# Altium schematic sheet OPA847_LNA.SchDoc
size A4; SheetNumber: 3; SheetTotal: 9
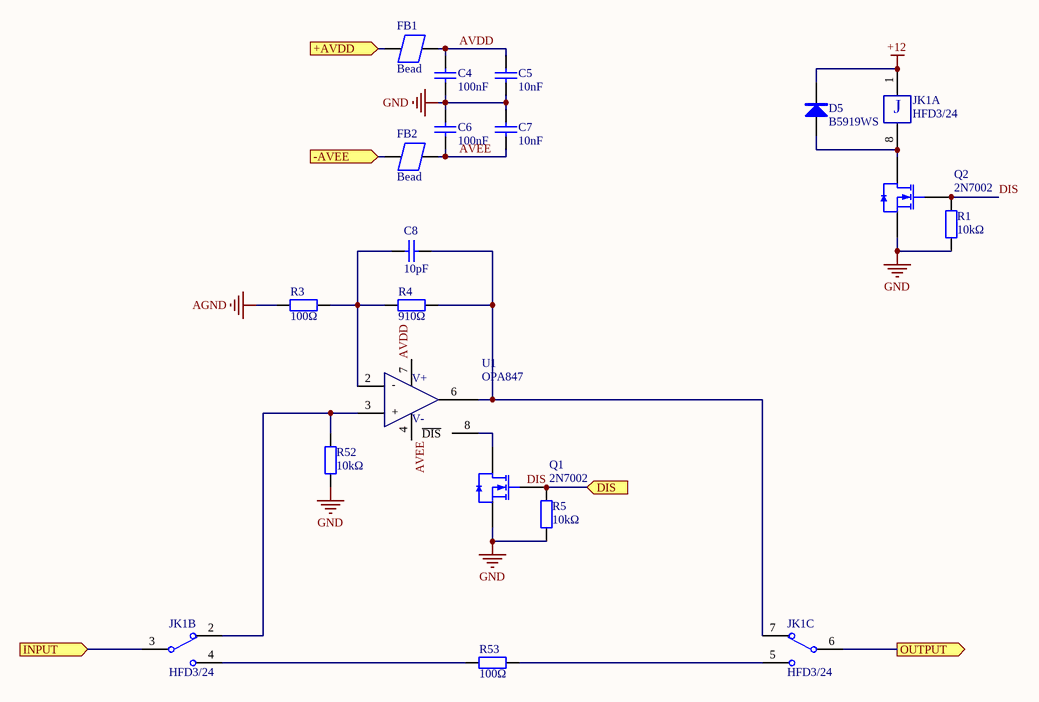
[diagram p0: OPA847_LNA.SchDoc]

## Parts
C4  100nF  [0603_C]
C5  10nF  [0603_C]
C6  100nF  [0603_C]
C7  10nF  [0603_C]
C8  10pF  [0603_C]
D5  B5919WS  [SOD-323]
FB1  Bead  [0805_L]
FB2  Bead  [0805_L]
JK1  HFD3/24  [HFD3-DIP]  (parts A,B,C of 3)
Q1  2N7002  [SOT-23(SOT-23-3)]
Q2  2N7002  [SOT-23(SOT-23-3)]
R1  10kΩ  [0603_R]
R3  100Ω  [0603_R]
R4  910Ω  [0603_R]
R5  10kΩ  [0603_R]
R52  10kΩ  [0603_R]
R53  100Ω  [0603_R]
U1  OPA847  [SOIC127P600X175-8M]

## Ports
+AVDD (in), -AVEE (in), DIS (in), INPUT (in), OUTPUT (out)

## Nets
+12: D5.2(K) JK1.1
AGND: R3.1
GND: C4.1 C5.1 C6.1 C7.1 Q1.2(S) Q2.2(S) R1.1 R5.1 R52.1
+AVDD: FB1.1 ; port +AVDD
-AVEE: FB2.1 ; port -AVEE
AVDD: C4.2 C5.2 FB1.2 U1.7(VCC+)
AVEE: C6.2 C7.2 FB2.2 U1.4(VCC-)
DIS: Q1.1(G) R5.2 ; port DIS
DIS: Q2.1(G) R1.2  [a separate net that carries the same name]
INPUT: JK1.3 ; port INPUT
OUTPUT: JK1.6 ; port OUTPUT
NetC8_1: C8.1 R3.2 R4.1 U1.2
NetC8_2: C8.2 JK1.7 R4.2 U1.6
NetD5_1: D5.1(A) JK1.8 Q2.3(D)
NetJK1_2: JK1.2 R52.2 U1.3
NetJK1_4: JK1.4 R53.2
NetJK1_5: JK1.5 R53.1
NetQ1_3: Q1.3(D) U1.8(~{DIS})

## Notes on the sheet
- Labels drawn without touching a wire or pin: DIS
- (in symbol HFD3, part A) J
- (in symbol OPA847) V+; -; +; V-

## Library data of the parts
C4 C6 = 0603 100nF (104) 10% 50V: 贴片电容; ComponentLink1Description: 供应商链接; ComponentLink1URL: http://www.szlcsc.com/product/details_15331.html; Package: 0603; Supplier: LC; SuppliersPartNumber: C14663
C5 C7 = 0603 10nF (103) 10% 50V: 贴片电容; ComponentLink1Description: 供应商链接; ComponentLink1URL: http://www.szlcsc.com/product/details_58143.html; Package: 0603; Supplier: LC; SuppliersPartNumber: C57112
C8 = 0603 10pF (100) 5% 50V: 贴片电容; ComponentLink1Description: 供应商链接; ComponentLink1URL: http://www.szlcsc.com/product/details_1986.html; Package: 0603; Supplier: LC; SuppliersPartNumber: C1634
D5 = 1N5819: 肖特基二极管; 版权归属: 源创客; 属性: 40V/2A; BOM名称: 肖特基二极管; 学习资源: www.ooocke.com
JK1 = HFD3: 超小型两组转换; BOM名称: 两组转换继电器; 版权归属: 源创客; 学习资源: www.ooocke.com
Q1 Q2 = 2N7002 7002: MOS(场效应管); ComponentLink1Description: 供应商链接; ComponentLink1URL: http://www.szlcsc.com/product/details_9040.html; Package: SOT-23(SOT-23-3); Supplier: LC; SuppliersPartNumber: C8545
R1 R5 = 0603 10KΩ (1002) 1%: 贴片电阻; ComponentLink1Description: 供应商链接; ComponentLink1URL: http://www.szlcsc.com/product/details_26547.html; Package: 0603; Supplier: LC; SuppliersPartNumber: C25804
R3 R52 R53 = 0603 100Ω (1000) 1%: 贴片电阻; ComponentLink1Description: 供应商链接; ComponentLink1URL: http://www.szlcsc.com/product/details_23502.html; Package: 0603; Supplier: LC; SuppliersPartNumber: C22775
R4 = 0603 910Ω (9100) 1%: 贴片电阻; ComponentLink1Description: 供应商链接; ComponentLink1URL: http://www.szlcsc.com/product/details_23991.html; Package: 0603; Supplier: LC; SuppliersPartNumber: C23264
U1 = OPA847: Wideband, Ultra-Low Noise, Voltage-Feedback OPERATIONAL AMPLIFIER with Shutdown